# Altium schematic sheet BlinkingLED.SchDoc
size C
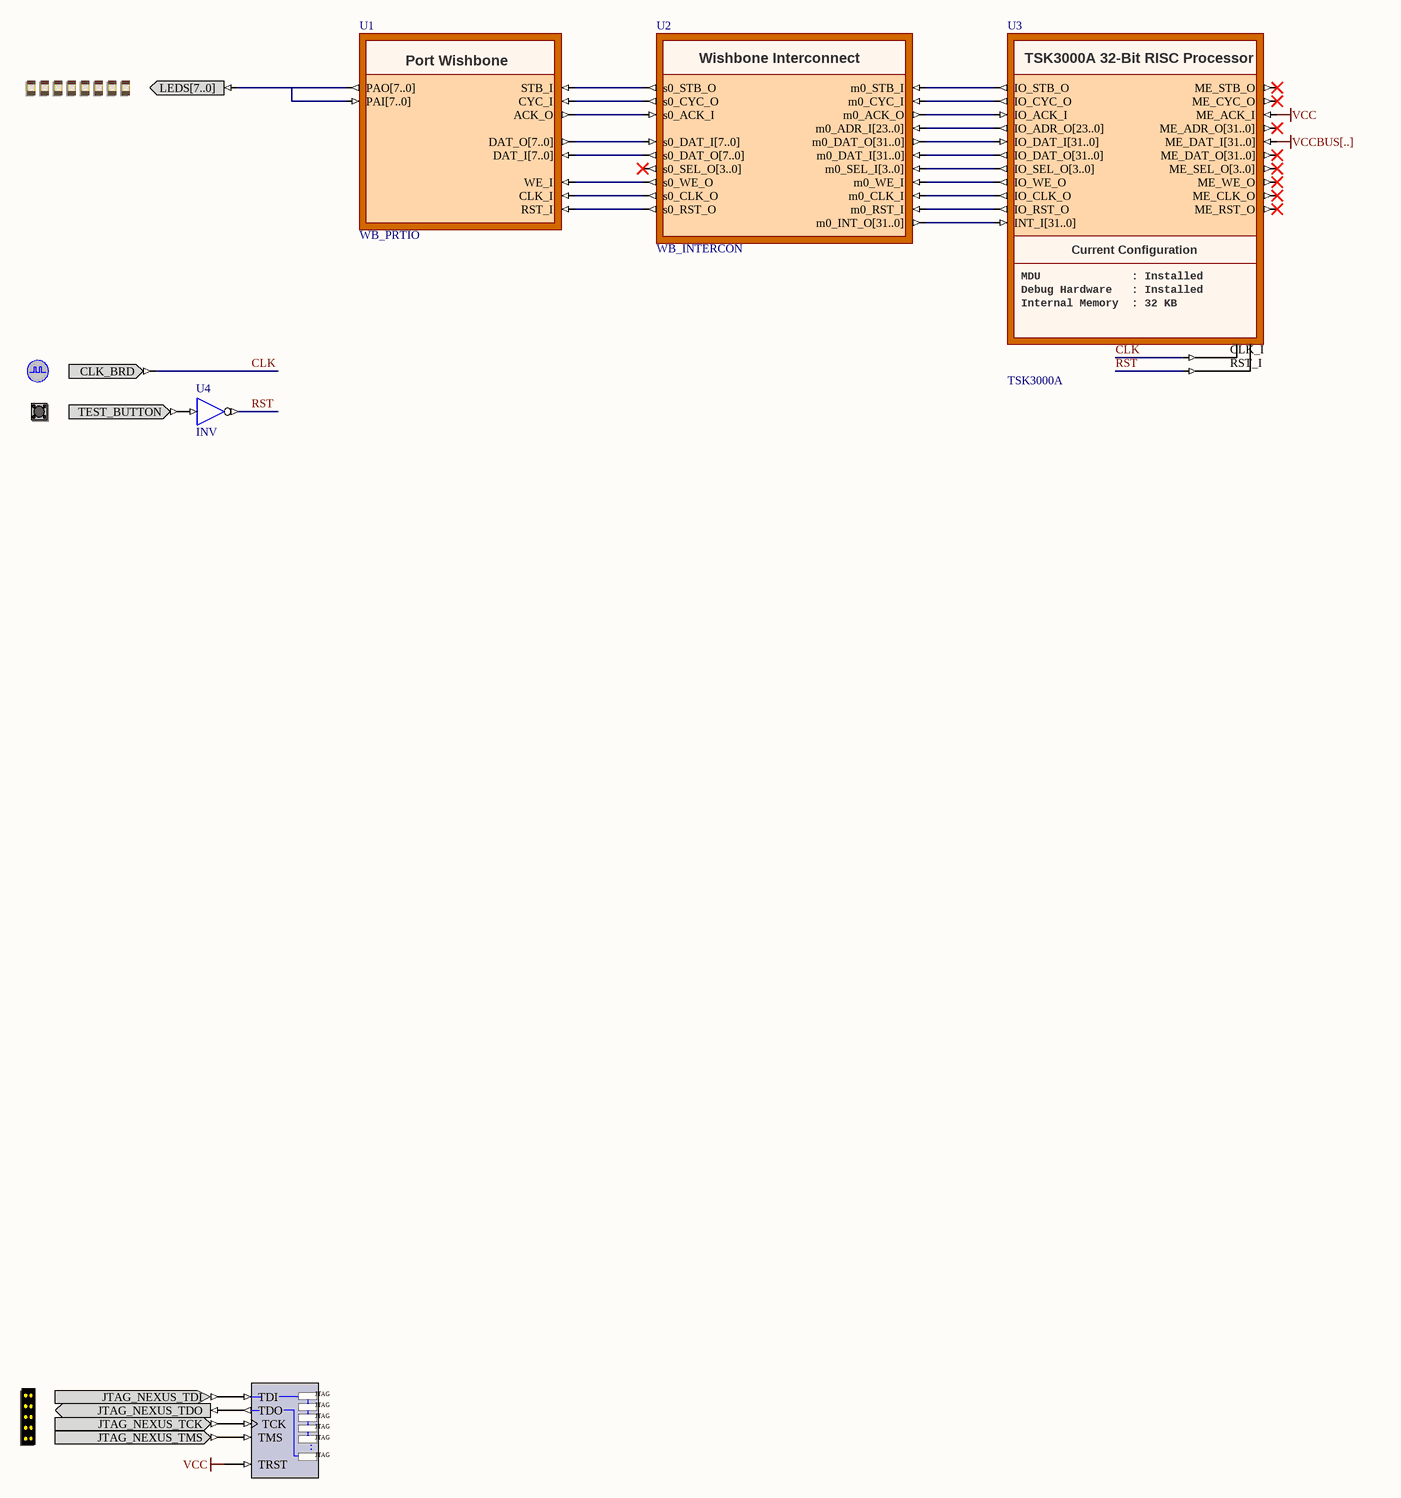
[diagram p0: BlinkingLED.SchDoc]

## Parts
(Parts that share a designator on the sheet are numbered #1, #2 ... from top to bottom, then left to right.)
?#1  LED  (value not drawn)
?#2  CLOCK_BOARD  (value not drawn)
?#3  TEST_BUTTON  (value not drawn)
?#4  NEXUS_JTAG_CONNECTOR  (value not drawn)
NEXUS_JTAG_PORT  NEXUS_JTAG_PORT  (value not drawn)
U1  WB_PRTIO
U2  WB_INTERCON
U3  TSK3000A
U4  INV

## Nets
VCC: NEXUS_JTAG_PORT.TRST U3.ME_ACK_I
VCCBUS[..]: U3.ME_DAT_I[31..0]
CLK: ?#2.CLK_BRD U3.CLK_I
RST: U3.RST_I U4.O
Net?#1_LEDS[7..0]: ?#1.LEDS[7..0] U1.PAI[7..0] U1.PAO[7..0]
Net?#3_TEST_BUTTON: ?#3.TEST_BUTTON U4.I
Net?#4_JTAG_NEXUS_TCK: ?#4.JTAG_NEXUS_TCK NEXUS_JTAG_PORT.TCK
Net?#4_JTAG_NEXUS_TDI: ?#4.JTAG_NEXUS_TDI NEXUS_JTAG_PORT.TDI
Net?#4_JTAG_NEXUS_TDO: ?#4.JTAG_NEXUS_TDO NEXUS_JTAG_PORT.TDO
Net?#4_JTAG_NEXUS_TMS: ?#4.JTAG_NEXUS_TMS NEXUS_JTAG_PORT.TMS
NetU1_ACK_O: U1.ACK_O U2.s0_ACK_I
NetU1_CLK_I: U1.CLK_I U2.s0_CLK_O
NetU1_CYC_I: U1.CYC_I U2.s0_CYC_O
NetU1_DAT_I[7..0]: U1.DAT_I[7..0] U2.s0_DAT_O[7..0]
NetU1_DAT_O[7..0]: U1.DAT_O[7..0] U2.s0_DAT_I[7..0]
NetU1_RST_I: U1.RST_I U2.s0_RST_O
NetU1_STB_I: U1.STB_I U2.s0_STB_O
NetU1_WE_I: U1.WE_I U2.s0_WE_O
NetU2_m0_ACK_O: U2.m0_ACK_O U3.IO_ACK_I
NetU2_m0_ADR_I[23..0]: U2.m0_ADR_I[23..0] U3.IO_ADR_O[23..0]
NetU2_m0_CLK_I: U2.m0_CLK_I U3.IO_CLK_O
NetU2_m0_CYC_I: U2.m0_CYC_I U3.IO_CYC_O
NetU2_m0_DAT_I[31..0]: U2.m0_DAT_I[31..0] U3.IO_DAT_O[31..0]
NetU2_m0_DAT_O[31..0]: U2.m0_DAT_O[31..0] U3.IO_DAT_I[31..0]
NetU2_m0_INT_O[31..0]: U2.m0_INT_O[31..0] U3.INT_I[31..0]
NetU2_m0_RST_I: U2.m0_RST_I U3.IO_RST_O
NetU2_m0_SEL_I[3..0]: U2.m0_SEL_I[3..0] U3.IO_SEL_O[3..0]
NetU2_m0_STB_I: U2.m0_STB_I U3.IO_STB_O
NetU2_m0_WE_I: U2.m0_WE_I U3.IO_WE_O

Not connected (* = marked no-connect by the designer): U2 s0_SEL_O[3..0]*; U3 ME_ADR_O[31..0]* ME_CLK_O* ME_CYC_O* ME_DAT_O[31..0]* ME_RST_O* ME_SEL_O[3..0]* ME_STB_O* ME_WE_O*

## Notes on the sheet
- (in symbol NEXUS_JTAG_PORT) .
- (in symbol TSK3000A) TSK3000A 32-Bit RISC Processor; Current Configuration; MDU              : Installed; Debug Hardware   : Installed; Internal Memory  : 32 KB
- (in symbol WB_INTERCON) Wishbone Interconnect
- (in symbol WB_PRTIO) Port Wishbone

## Library data of the parts
?#1 = LED: Bank of eight Red LEDs; PortComponent: True; Published: 19-Nov-2003; Publisher: Altium Limited; HelpURL: TR0143 NanoBoard Technical Reference Manual - NB2.pdf#page=45
?#2 = CLOCK_BOARD: Global System Clock Supply; PortComponent: True; Published: 19-Nov-2003; Publisher: Altium Limited; HelpURL: TR0143 NanoBoard Technical Reference Manual - NB2.pdf#page=36; UseInDSF: True
?#3 = TEST_BUTTON: Test / Reset Button; PortComponent: True; Published: 19-Nov-2003; Publisher: Altium Limited; HelpURL: TR0143 NanoBoard Technical Reference Manual - NB2.pdf#page=47
?#4 = NEXUS_JTAG_CONNECTOR: JTAG Port; PortComponent: True; Published: 19-Nov-2003; Publisher: Altium Limited; HelpURL: TR0143 NanoBoard Technical Reference Manual - NB2.pdf#page=48
NEXUS_JTAG_PORT = NEXUS_JTAG_PORT: Soft Nexus-Chain Connector; NEXUS_JTAG_CONNECTOR: True; FunctionalClass: JTAG; Published: 29-Jan-2004; Publisher: Altium Limited; LastRevisionNo: 1.00.00; HelpURL: CR0118 FPGA Generic Library Guide.pdf#page=405
U1 = WB_PRTIO: Configurable Port Wishbone; ChildModel: PRTIO1X8_W; UseInDSF: True; ConfigurationParameters: {}Version[1.0]{}PortCount[1]{}BusWidth[8]{}PortKind[0]{}; ComponentLink1Description: Core &Resource Usage; ComponentLink1URL: CR0139 FPGA Peripheral Resource Usage.pdf#page=98; HelpURL: CR0154 WB_PRTIO Configurable Wishbone Parallel Port Unit.pdf; LastRevisionNo: 1.00.00; Published: 9-Dec-2004; Publisher: Altium Limited; ConfiguratorName: WB_PRTIO
U2 = WB_INTERCON: Configurable Wishbone Interconnect; ConfigurationParameters: {}Version[1.0]{}UnusedInterrupts[1]{}MasterAddressBits[1]{}Name0[GPIO]{}Kind0[0]{}SpaceAfter0[4]{}Address_Base0[0]{}Address_Bits0[0]{}Address_Mode0[1]{}Address_DecodeWidth0[8]{}DataWidth0[2]{}UsedInterrupts0[ ]; ComponentLink1Description: Core &Resource Usage; ComponentLink1URL: CR0139 FPGA Peripheral Resource Usage.pdf#page=78; HelpURL: CR0150 WB_INTERCON Configurable Wishbone Interconnect.pdf; LastRevisionNo: 1.00.00; Published: 9-Dec-2004; Publisher: Altium Limited; ConfiguratorName: WB_INTERCON
U3 = TSK3000A: TSK3000A OCD Microprocessor; Nexus_JTAG_Device: True; Nexus_Core: Processor_OCDS; Nexus_JTAG_Order: 0; ConfigurationParameters: {}Version[1.0]{}Option_Processor[0]{}Option_Memory[5]{}Option_MDU[0]{}Option_OCDS[0]{}Option_Shifter[0]{}Option_InterruptCount[32]{}Option_DebugWhenReset[0]{}; ConfiguratorName: FPGA_MCU32; Memory_Configuration: Record[AUTOIMPORT]{}AutoImport_Memory[False]{}AutoImport_Peripherals[False]{n}Record[PERIPHERAL]{}ComponentDesignator[GPIO]{}Memory_Depth[0x0001]{}Memory_UsageType[peripheral]{}ProgramDownloadAddress[0xFF000000]{}Memory_BusType[TSK3000:addr_bus]{}Memory_Mau[8]{}Memory_MatchedComponent[]{}Memory_Description[U2]{}Memory_FillBitPattern[]{}Memory_IncludeDependencies[False]{}Memory_ByLoadAddress[False]{}Memory_Interrupts[]{n}Record[PHYSICAL_MEMORY]{}ComponentDesignator[U3]{}Memory_Depth[32768]{}Memory_UsageType[ram]{}ProgramDownloadAddress[0x00000000]{}Memory_BusType[TSK3000:addr_bus]{}Memory_Mau[0x00000008]{}Memory_MatchedComponent[]{}Memory_Description[]{}Memory_FillBitPattern[]{}Memory_IncludeDependencies[False]{}Memory_ByLoadAddress[False]{}Memory_Interrupts[]{n}Record[CODE_EXPORT]{}ExportType[1]{n}Record[NEXUS_CORE]{}ComponentDesignator[U3]{}Memory_Depth[32768]{}Memory_UsageType[ram]{}ProgramDownloadAddress[0x00000000]{}Memory_BusType[TSK3000:addr_bus]{}Memory_Mau[0x00000008]{}Memory_MatchedComponent[]{}Memory_Description[]{}Memory_FillBitPattern[]{}Memory_IncludeDependencies[False]{}Memory_ByLoadAddress[False]{}Memory_Interrupts[]{n}; ChildModel1: TSK3000A_MCU; ChildModel2: TSK3000A_MDU; ChildModel3: TSK3000A_OCDS; ChildModel4: TSK3000A_Shift_Barrel; ChildModel5: TSK3000A_Shift_Sequential; ChildModel6: Mult_32x32; ChildModel7: m33x33; ProgramLogicalTopAddress: 0; ComponentLink1Description: Core &Resource Usage; ComponentLink1URL: CR0140 FPGA Processor Resource Usage.pdf#page=22; HelpURL: CR0121 TSK3000A 32 bit RISC Processor.pdf; LastRevisionNo: 1.00.00; Published: 17-Nov-2004; Publisher: Altium Limited; ComponentLink2Description: Embedded &Tools Guide; ComponentLink2URL: GU0111 Using the TSK3000 Embedded Tools.pdf; ComponentLink3Description: Embedded T&echnical References; ComponentLink3URL: TR0109 TSK3000 Embedded Tools Reference.pdf
U4 = INV: Inverter; FunctionalClass: Logic Primitive; ArchiveName: GENERIC; VHDLIB_SIM: GENERIC_LIB; Published: 29-Jan-2004; Publisher: Altium Limited; XilinxEquivalent: INV; LastRevisionNo: 1.00.00; HelpURL: CR0118 FPGA Generic Library Guide.pdf#page=291; ComponentLink1URL: CR0136 FPGA Logic Primitive Resource Usage.pdf#page=61; ComponentLink1Description: Core &Resource Usage; SubClass: INV